# Altium schematic sheet 1_PM25_STM8S003_Sch.SchDoc
size A0
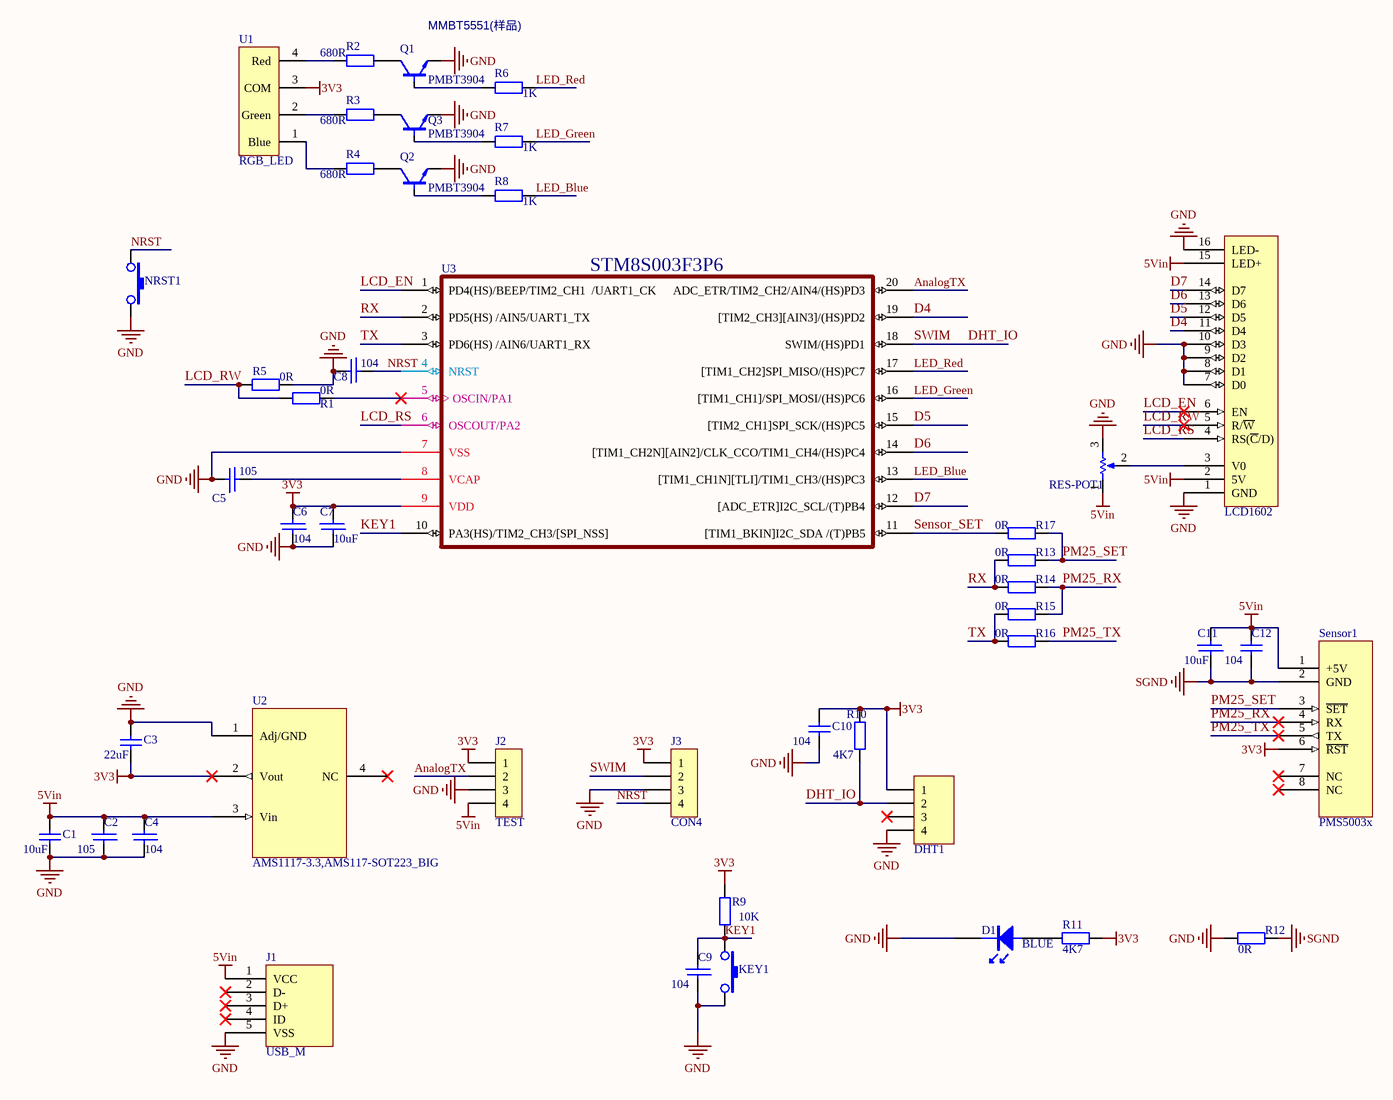
[diagram p0: 1_PM25_STM8S003_Sch.SchDoc]

## Parts
C1  value 10uF  [LC0805_Std]  (hidden comment: 10uF (106) ±10% 25V,0805)
C2  value 105  [LC0603_Std]  (hidden comment: 1uF (105) ±10% 50V)
C3  value 22uF  [LC0805_Std]  (hidden comment: 22uF (226) ±20% 25V,0805)
C4  value 104  [LC0603_Std]  (hidden comment: 100nF (104) ±10% 50V,0603)
C5  value 105  [LC0603_Std]  (hidden comment: 1uF (105) ±10% 50V,0603)
C6  value 104  [LC0603_Std]  (hidden comment: 100nF (104) ±10% 50V,0603)
C7  value 10uF  [LC0603_Std]  (hidden comment: 10uF (106) ±10% 10V,0603)
C8  value 104  [LC0603_Std]  (hidden comment: 100nF (104) ±10% 50V,0603)
C9  value 104  [LC0603_Std]  (hidden comment: 100nF (104) ±10% 50V,0603)
C10  value 104  [LC0603_Std]  (hidden comment: 100nF (104) ±10% 50V,0603)
C11  value 10uF  [LC0603_Std]  (hidden comment: 10uF (106) ±10% 10V,0603)
C12  value 104  [LC0603_Std]  (hidden comment: 100nF (104) ±10% 50V,0603)
D1  value BLUE  [LC0805_Std]  (hidden comment: C2293, 蓝灯,发光二极, C2293,0805)
DHT1  Header 4  [DHT11]  (value not drawn)
J1  USB_M  [micro-USB-B]
J2  TEST  [HDR1X4]
J3  CON4  [HDR1X4]
KEY1  轻触开关  [轻触开关-6x6x6]  (value not drawn)
LCD1  LCD1602  [LCD1602_KS0066]
NRST1  轻触开关  [轻触开关-6x6x6]  (value not drawn)
Q1  PMBT3904  [SOT23-NPN]
Q2  PMBT3904  [SOT23-NPN]
Q3  PMBT3904  [SOT23-NPN]
R1  value 0R  [LC0603_Std]  (hidden comment: 0Ω (0R0) ±1%,0805)
R2  value 680R  [LC0603_Std]  (hidden comment: 680Ω (6800) ±1%)
R3  value 680R  [LC0603_Std]  (hidden comment: 680Ω (6800) ±1%)
R4  value 680R  [LC0603_Std]  (hidden comment: 680Ω (6800) ±1%)
R5  value 0R  [LC0603_Std]  (hidden comment: 0Ω (0R0) ±1%,0805)
R6  value 1K  [LC0603_Std]  (hidden comment: 1KΩ (1001) ±1%)
R7  value 1K  [LC0603_Std]  (hidden comment: 1KΩ (1001) ±1%)
R8  value 1K  [LC0603_Std]  (hidden comment: 1KΩ (1001) ±1%)
R9  value 10K  [LC0603_Std]  (hidden comment: 10KΩ (1002) ±1%)
R10  value 4K7  [LC0603_Std]  (hidden comment: 4.7KΩ (4701) ±1%,0603)
R11  value 4K7  [LC0603_Std]  (hidden comment: 4.7KΩ (4701) ±1%,0603)
R12  value 0R  [LC0603_Std]  (hidden comment: 0Ω (0R0) ±1%)
R13  value 0R  [LC0603_Std]  (hidden comment: 0Ω (0R0) ±1%)
R14  value 0R  [LC0603_Std]  (hidden comment: 0Ω (0R0) ±1%)
R15  value 0R  [LC0603_Std]  (hidden comment: 0Ω (0R0) ±1%)
R16  value 0R  [LC0603_Std]  (hidden comment: 0Ω (0R0) ±1%)
R17  value 0R  [LC0603_Std]  (hidden comment: 0Ω (0R0) ±1%)
RES-POT1  RES-POT-RM0065-V1  [RES-POT-RM0065-V1]  (value not drawn)
Sensor1  PMS5003x  [PM25_Header]
U1  RGB_LED  [LED_RGB]
U2  AMS1117-3.3,AMS117-SOT223_BIG  [SOT-223_Std]
U3  STM8S003F3P6  [TSSOP20-STM8S003F3P6]

## Nets
3V3: C3.2 C6.1 C7.2 C10.1 DHT1.1 J2.1 J3.1 R9.2 R10.2 R11.1 Sensor1.6(~{RST}) U1.3(COM) U2.2(Vout) U3.9(VDD)
5Vin: C1.1 C2.1 C4.1 C11.2 C12.2 J1.1(VCC) J2.4 LCD1.2(5V) LCD1.15(LED+) RES-POT1.1(TOP) Sensor1.1(+5V) U2.3(Vin)
GND: C1.2 C2.2 C3.1 C4.2 C5.2 C6.2 C7.1 C8.1 C9.2 C10.2 D1.K DHT1.4 J1.5(VSS) J2.3 J3.3 KEY1.2 LCD1.1(GND) LCD1.7(D0) LCD1.8(D1) LCD1.9(D2) LCD1.10(D3) LCD1.16(LED-) NRST1.2 Q1.2(e) Q2.2(e) Q3.2(e) R5.2 R12.2 RES-POT1.3(BOT) U2.1(Adj/GND) U3.7(VSS)
SGND: C11.1 C12.1 R12.1 Sensor1.2(GND)
AnalogTX: J2.2 U3.20(ADC_ETR/TIM2_CH2/AIN4/(HS)PD3)
D4: LCD1.11(D4) U3.19([TIM2_CH3][AIN3]/(HS)PD2)
D5: LCD1.12(D5) U3.15([TIM2_CH1]SPI_SCK/(HS)PC5)
D6: LCD1.13(D6) U3.14([TIM1_CH2N][AIN2]/CLK_CCO/TIM1_CH4/(HS)PC4)
D7: LCD1.14(D7) U3.12([ADC_ETR]I2C_SCL/(T)PB4)
DHT_IO: DHT1.2 J3.2 R10.1 U3.18(SWIM/(HS)PD1)  [also labelled SWIM]
KEY1: C9.1 KEY1.1 R9.1 U3.10(PA3(HS)/TIM2_CH3/[SPI_NSS])
LCD_EN: LCD1.6(EN) U3.1(PD4(HS)/BEEP/TIM2_CH1__/UART1_CK)
LCD_RS: LCD1.4(RS(~{C}/D)) U3.6(OSCOUT/PA2)
LCD_RW: LCD1.5(R/~{W}) R1.1 R5.1
LED_Blue: R8.2 U3.13([TIM1_CH1N][TLI]/TIM1_CH3/(HS)PC3)
LED_Green: R7.1 U3.16([TIM1_CH1]/SPI_MOSI/(HS)PC6)
LED_Red: R6.1 U3.17([TIM1_CH2]SPI_MISO/(HS)PC7)
NRST: C8.2 J3.4 NRST1.1 U3.4(NRST)
PM25_RX: R14.1 R15.1 Sensor1.4(RX)
PM25_SET: R13.1 R17.1 Sensor1.3(~{SET})
PM25_TX: R16.1 Sensor1.5(TX)
RX: R13.2 R14.2 U3.2(PD5(HS)_/AIN5/UART1_TX)
Sensor_SET: R17.2 U3.11([TIM1_BKIN]I2C_SDA_/(T)PB5)
TX: R15.2 R16.2 U3.3(PD6(HS)_/AIN6/UART1_RX)
NetC5_1: C5.1 U3.8(VCAP)
NetD1_A: D1.A R11.2
NetLCD1_3: LCD1.3(V0) RES-POT1.2(TAP)
NetQ1_1: Q1.1(b) R6.2
NetQ1_3: Q1.3(c) R2.1
NetQ2_1: Q2.1(b) R8.1
NetQ2_3: Q2.3(c) R4.1
NetQ3_1: Q3.1(b) R7.2
NetQ3_3: Q3.3(c) R3.1
NetR1_2: R1.2 U3.5(OSCIN/PA1)
NetR2_2: R2.2 U1.4(Red)
NetR3_2: R3.2 U1.2(Green)
NetR4_2: R4.2 U1.1(Blue)

Not connected (* = marked no-connect by the designer): DHT1 3*; J1 2(D-)* 3(D+)* 4(ID)*; Sensor1 7(NC)* 8(NC)*; U2 4(NC)*

## Notes on the sheet
- (near Q1) MMBT5551(样品)

## Library data of the parts
C1 C3 C10 C12 = Cap: Capacitor; Published: 8-Jun-2000; LatestRevisionDate: 17-Jul-2002; LatestRevisionNote: Re-released for DXP Platform.; PackageReference: RAD-0.3; Publisher: Altium Limited
C2 C4-C9 C11 = 普通电容
D1 = LED
DHT1 = Header 4: 接插件; LatestRevisionDate: 17-Jul-2002; LatestRevisionNote: Re-released for DXP Platform.; Publisher: Altium Limited
J1 = USB_M: MicroUSB接口
J2 = CON4
LCD1 = LCD1602_KS0066
Q1-Q3 = NPN
R1 R5 R10-R17 = Res2: Resistor; Published: 8-Jun-2000; LatestRevisionDate: 17-Jul-2002; LatestRevisionNote: Re-released for DXP Platform.; PackageReference: AXIAL-0.4; Publisher: Altium Limited
R2-R4 R6-R9 = 电阻
Sensor1 = PMS5003x_Sensor
U2 = AMS117-SOT223_BIG: AMS1117-SOT223-1Adj/GND-2Vout-3Vin
U3 = STM8S103F2P6: ST 8-bit  Microcontroller